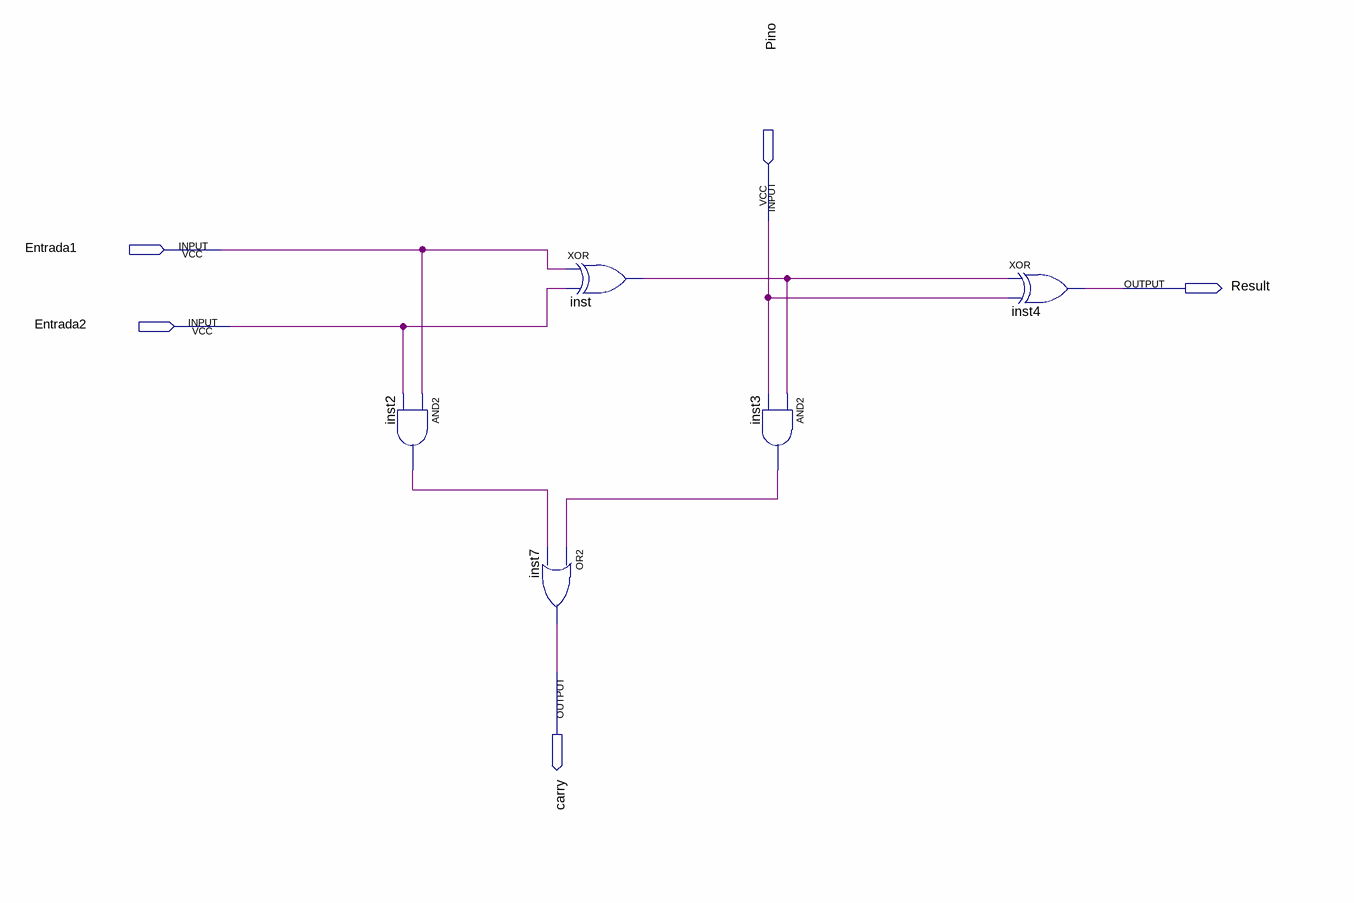
[diagram p0: schematic sheet]
// Quartus schematic Soma.bdf as structural Verilog: 5 symbols, 5 pins
module Soma (
  input  Pino,
  input  Entrada1,
  input  Entrada2,
  output Result,
  output carry
);

  wire inst2_out, inst3_out, inst_out;

  and inst2 (inst2_out, Entrada1, Entrada2);
  xor inst (inst_out, Entrada1, Entrada2);
  or inst7 (carry, inst3_out, inst2_out);
  and inst3 (inst3_out, inst_out, Pino);
  xor inst4 (Result, inst_out, Pino);
endmodule
